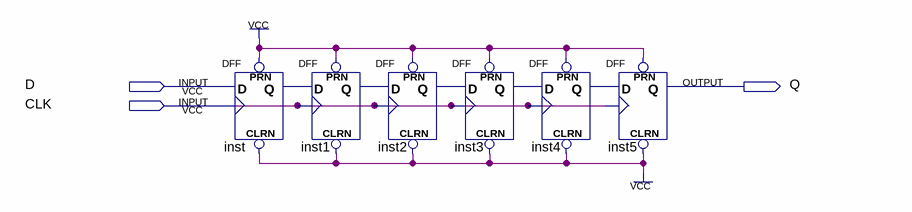
[diagram p0: schematic sheet]
// Quartus schematic sr6.bdf as structural Verilog: 6 symbols, 3 pins
module sr6 (
  input  D,
  input  CLK,
  output Q
);

  wire inst1_q, inst2_q, inst3_q, inst4_q, inst_q;

  DFF inst (.CLRN(1'b1), .CLK(CLK), .D(D), .PRN(1'b1), .Q(inst_q));
  DFF inst1 (.CLRN(1'b1), .CLK(CLK), .D(inst_q), .PRN(1'b1), .Q(inst1_q));
  DFF inst2 (.CLRN(1'b1), .CLK(CLK), .D(inst1_q), .PRN(1'b1), .Q(inst2_q));
  DFF inst3 (.CLRN(1'b1), .CLK(CLK), .D(inst2_q), .PRN(1'b1), .Q(inst3_q));
  DFF inst4 (.CLRN(1'b1), .CLK(CLK), .D(inst3_q), .PRN(1'b1), .Q(inst4_q));
  DFF inst5 (.CLRN(1'b1), .CLK(CLK), .D(inst4_q), .PRN(1'b1), .Q(Q));
endmodule
